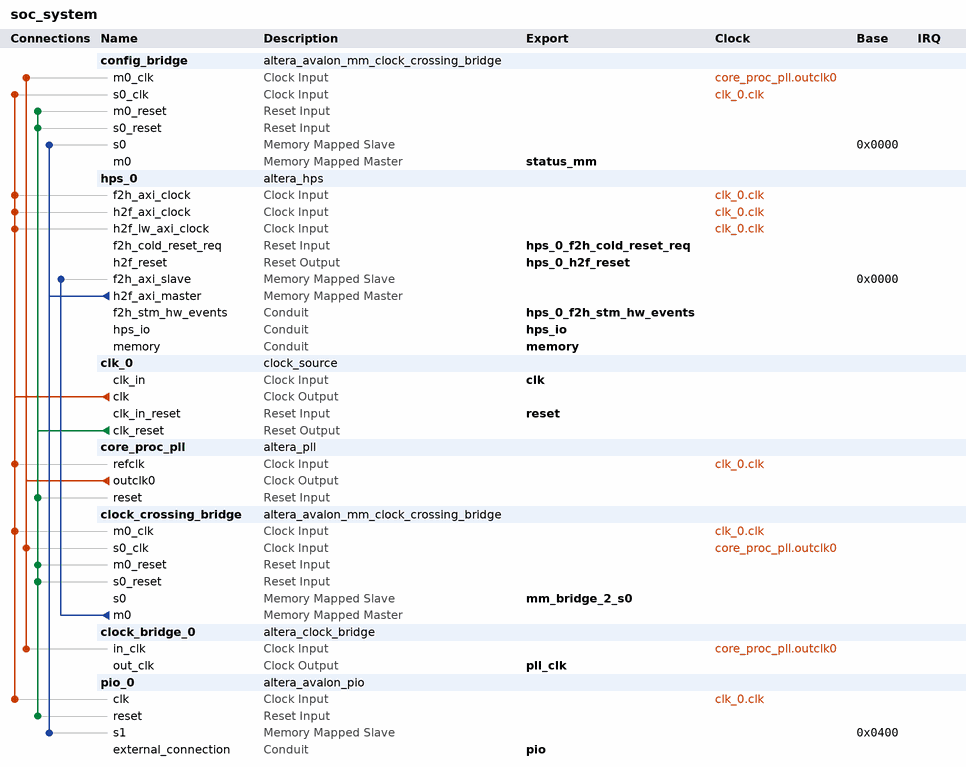
[diagram p0: system contents]
# Platform Designer (Qsys) system soc_system, Cyclone V 5CSEBA6U23I7
# Parameters at their usual value, and those the tool derives, are not listed.
package require -exact qsys 18.0
create_system soc_system
set_project_property DEVICE_FAMILY {Cyclone V}
set_project_property DEVICE 5CSEBA6U23I7

add_instance config_bridge altera_avalon_mm_clock_crossing_bridge 18.0
set_instance_parameter_value config_bridge ADDRESS_UNITS WORDS
set_instance_parameter_value config_bridge ADDRESS_WIDTH 10
set_instance_parameter_value config_bridge COMMAND_FIFO_DEPTH 4
set_instance_parameter_value config_bridge DATA_WIDTH 32
set_instance_parameter_value config_bridge MASTER_SYNC_DEPTH 2
set_instance_parameter_value config_bridge MAX_BURST_SIZE 1
set_instance_parameter_value config_bridge RESPONSE_FIFO_DEPTH 4
set_instance_parameter_value config_bridge SLAVE_SYNC_DEPTH 2
set_instance_parameter_value config_bridge USE_AUTO_ADDRESS_WIDTH 1

add_instance hps_0 altera_hps 18.0
set_instance_parameter_value hps_0 EMAC1_Mode RGMII
set_instance_parameter_value hps_0 EMAC1_PinMuxing {HPS I/O Set 0}
set_instance_parameter_value hps_0 F2SCLK_COLDRST_Enable true
set_instance_parameter_value hps_0 F2SCLK_DBGRST_Enable false
set_instance_parameter_value hps_0 F2SCLK_WARMRST_Enable false
set_instance_parameter_value hps_0 F2SINTERRUPT_Enable false
set_instance_parameter_value hps_0 F2S_Width 3
set_instance_parameter_value hps_0 FPGA_PERIPHERAL_OUTPUT_CLOCK_FREQ_EMAC0_GTX_CLK 100
set_instance_parameter_value hps_0 FPGA_PERIPHERAL_OUTPUT_CLOCK_FREQ_EMAC0_MD_CLK 100.0
set_instance_parameter_value hps_0 FPGA_PERIPHERAL_OUTPUT_CLOCK_FREQ_EMAC1_GTX_CLK 100
set_instance_parameter_value hps_0 FPGA_PERIPHERAL_OUTPUT_CLOCK_FREQ_EMAC1_MD_CLK 100.0
set_instance_parameter_value hps_0 HPS_PROTOCOL DDR3
set_instance_parameter_value hps_0 I2C0_Mode I2C
set_instance_parameter_value hps_0 I2C0_PinMuxing {HPS I/O Set 0}
set_instance_parameter_value hps_0 I2C1_Mode I2C
set_instance_parameter_value hps_0 I2C1_PinMuxing {HPS I/O Set 0}
set_instance_parameter_value hps_0 LWH2F_Enable true
set_instance_parameter_value hps_0 MEM_BANKADDR_WIDTH 3
set_instance_parameter_value hps_0 MEM_CLK_FREQ 400.0
set_instance_parameter_value hps_0 MEM_COL_ADDR_WIDTH 10
set_instance_parameter_value hps_0 MEM_DQ_WIDTH 32
set_instance_parameter_value hps_0 MEM_DRV_STR RZQ/6
set_instance_parameter_value hps_0 MEM_ROW_ADDR_WIDTH 15
set_instance_parameter_value hps_0 MEM_RTT_NOM RZQ/6
set_instance_parameter_value hps_0 MEM_RTT_WR {Dynamic ODT off}
set_instance_parameter_value hps_0 MEM_TCL 7
set_instance_parameter_value hps_0 MEM_TFAW_NS 37.5
set_instance_parameter_value hps_0 MEM_TRAS_NS 35.0
set_instance_parameter_value hps_0 MEM_TRCD_NS 13.75
set_instance_parameter_value hps_0 MEM_TRFC_NS 300.0
set_instance_parameter_value hps_0 MEM_TRP_NS 13.75
set_instance_parameter_value hps_0 MEM_VENDOR Other
set_instance_parameter_value hps_0 MEM_WTCL 7
set_instance_parameter_value hps_0 QSPI_Mode N/A
set_instance_parameter_value hps_0 QSPI_PinMuxing Unused
set_instance_parameter_value hps_0 REF_CLK_FREQ 25.0
set_instance_parameter_value hps_0 S2FCLK_USER2CLK 4
set_instance_parameter_value hps_0 S2F_Width 1
set_instance_parameter_value hps_0 SDIO_Mode {4-bit Data}
set_instance_parameter_value hps_0 SDIO_PinMuxing {HPS I/O Set 0}
set_instance_parameter_value hps_0 SPIM1_Mode {Single Slave Select}
set_instance_parameter_value hps_0 SPIM1_PinMuxing {HPS I/O Set 0}
set_instance_parameter_value hps_0 STM_Enable true
set_instance_parameter_value hps_0 TIMING_BOARD_AC_SKEW 0.02
set_instance_parameter_value hps_0 TIMING_BOARD_AC_TO_CK_SKEW 0.0
set_instance_parameter_value hps_0 TIMING_BOARD_DQ_TO_DQS_SKEW 0.0
set_instance_parameter_value hps_0 TIMING_BOARD_MAX_CK_DELAY 0.6
set_instance_parameter_value hps_0 TIMING_BOARD_MAX_DQS_DELAY 0.6
set_instance_parameter_value hps_0 TIMING_BOARD_SKEW_BETWEEN_DQS 0.02
set_instance_parameter_value hps_0 TIMING_BOARD_SKEW_CKDQS_DIMM_MAX 0.01
set_instance_parameter_value hps_0 TIMING_BOARD_SKEW_CKDQS_DIMM_MIN -0.01
set_instance_parameter_value hps_0 TIMING_BOARD_SKEW_WITHIN_DQS 0.02
set_instance_parameter_value hps_0 TIMING_TDH 125
set_instance_parameter_value hps_0 TIMING_TDQSCK 400
set_instance_parameter_value hps_0 TIMING_TDQSQ 120
set_instance_parameter_value hps_0 TIMING_TDS 50
set_instance_parameter_value hps_0 TIMING_TIH 250
set_instance_parameter_value hps_0 TIMING_TIS 175
set_instance_parameter_value hps_0 TIMING_TQSH 0.38
set_instance_parameter_value hps_0 UART0_Mode {No Flow Control}
set_instance_parameter_value hps_0 UART0_PinMuxing {HPS I/O Set 0}
set_instance_parameter_value hps_0 USB1_Mode SDR
set_instance_parameter_value hps_0 USB1_PinMuxing {HPS I/O Set 0}
set_instance_parameter_value hps_0 desired_cfg_clk_mhz 100.0
set_instance_parameter_value hps_0 desired_qspi_clk_mhz 370.0

add_instance clk_0 clock_source 18.0
set_instance_parameter_value clk_0 clockFrequency 50000000

add_instance core_proc_pll altera_pll 18.0
set_instance_parameter_value core_proc_pll gui_device_speed_grade 2
set_instance_parameter_value core_proc_pll gui_number_of_clocks 1
set_instance_parameter_value core_proc_pll gui_operation_mode direct
set_instance_parameter_value core_proc_pll gui_output_clock_frequency0 210.0
set_instance_parameter_value core_proc_pll gui_pll_mode {Fractional-N PLL}
set_instance_parameter_value core_proc_pll gui_reference_clock_frequency 50.0
set_instance_parameter_value core_proc_pll gui_use_locked false

add_instance clock_crossing_bridge altera_avalon_mm_clock_crossing_bridge 18.0
set_instance_parameter_value clock_crossing_bridge ADDRESS_WIDTH 10
set_instance_parameter_value clock_crossing_bridge COMMAND_FIFO_DEPTH 4
set_instance_parameter_value clock_crossing_bridge DATA_WIDTH 32
set_instance_parameter_value clock_crossing_bridge MASTER_SYNC_DEPTH 2
set_instance_parameter_value clock_crossing_bridge MAX_BURST_SIZE 4
set_instance_parameter_value clock_crossing_bridge RESPONSE_FIFO_DEPTH 8
set_instance_parameter_value clock_crossing_bridge SLAVE_SYNC_DEPTH 2
set_instance_parameter_value clock_crossing_bridge USE_AUTO_ADDRESS_WIDTH 1

add_instance clock_bridge_0 altera_clock_bridge 18.0
set_instance_parameter_value clock_bridge_0 DERIVED_CLOCK_RATE 210000000
set_instance_parameter_value clock_bridge_0 EXPLICIT_CLOCK_RATE 0

add_instance pio_0 altera_avalon_pio 18.0
set_instance_parameter_value pio_0 bitModifyingOutReg true
set_instance_parameter_value pio_0 direction Bidir
set_instance_parameter_value pio_0 width 8

# connections
add_connection clk_0.clk clock_crossing_bridge.m0_clk clock
add_connection clk_0.clk config_bridge.s0_clk clock
add_connection clk_0.clk core_proc_pll.refclk clock
add_connection clk_0.clk hps_0.f2h_axi_clock clock
add_connection clk_0.clk hps_0.h2f_axi_clock clock
add_connection clk_0.clk hps_0.h2f_lw_axi_clock clock
add_connection clk_0.clk pio_0.clk clock
add_connection core_proc_pll.outclk0 clock_bridge_0.in_clk clock
add_connection core_proc_pll.outclk0 clock_crossing_bridge.s0_clk clock
add_connection core_proc_pll.outclk0 config_bridge.m0_clk clock
add_connection clk_0.clk_reset clock_crossing_bridge.m0_reset reset
add_connection clk_0.clk_reset clock_crossing_bridge.s0_reset reset
add_connection clk_0.clk_reset config_bridge.m0_reset reset
add_connection clk_0.clk_reset config_bridge.s0_reset reset
add_connection clk_0.clk_reset core_proc_pll.reset reset
add_connection clk_0.clk_reset pio_0.reset reset
add_connection clock_crossing_bridge.m0 hps_0.f2h_axi_slave avalon
set_connection_parameter_value clock_crossing_bridge.m0/hps_0.f2h_axi_slave baseAddress 0x0000
add_connection hps_0.h2f_axi_master config_bridge.s0 avalon
set_connection_parameter_value hps_0.h2f_axi_master/config_bridge.s0 baseAddress 0x0000
add_connection hps_0.h2f_axi_master pio_0.s1 avalon
set_connection_parameter_value hps_0.h2f_axi_master/pio_0.s1 baseAddress 0x0400

# exported interfaces
add_interface clk clock sink
set_interface_property clk EXPORT_OF clk_0.clk_in
add_interface hps_0_f2h_cold_reset_req reset sink
set_interface_property hps_0_f2h_cold_reset_req EXPORT_OF hps_0.f2h_cold_reset_req
add_interface hps_0_f2h_stm_hw_events conduit end
set_interface_property hps_0_f2h_stm_hw_events EXPORT_OF hps_0.f2h_stm_hw_events
add_interface hps_0_h2f_reset reset source
set_interface_property hps_0_h2f_reset EXPORT_OF hps_0.h2f_reset
add_interface hps_io conduit end
set_interface_property hps_io EXPORT_OF hps_0.hps_io
add_interface memory conduit end
set_interface_property memory EXPORT_OF hps_0.memory
add_interface mm_bridge_2_s0 avalon slave
set_interface_property mm_bridge_2_s0 EXPORT_OF clock_crossing_bridge.s0
add_interface pio conduit end
set_interface_property pio EXPORT_OF pio_0.external_connection
add_interface pll_clk clock source
set_interface_property pll_clk EXPORT_OF clock_bridge_0.out_clk
add_interface reset reset sink
set_interface_property reset EXPORT_OF clk_0.clk_in_reset
add_interface status_mm avalon master
set_interface_property status_mm EXPORT_OF config_bridge.m0

set_interconnect_requirement {$system} qsys_mm.clockCrossingAdapter HANDSHAKE
set_interconnect_requirement {$system} qsys_mm.maxAdditionalLatency 1

save_system soc_system.qsys
